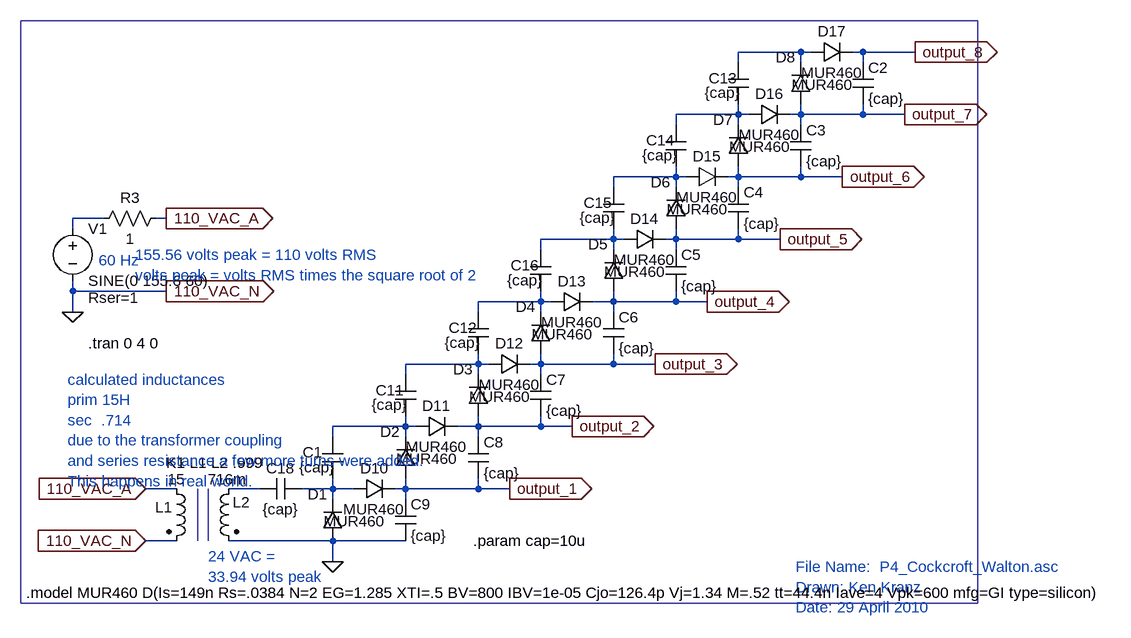
[diagram p0: schematic P4_Cockcroft_Walton.asc]
P4_Cockcroft_Walton.asc, the LTspice schematic file:
Version 4
SHEET 1 2216 1024
WIRE 960 -176 864 -176
WIRE 976 -176 960 -176
WIRE 1056 -176 1040 -176
WIRE 1136 -176 1056 -176
WIRE 864 -160 864 -176
WIRE 960 -160 960 -176
WIRE 1056 -160 1056 -176
WIRE 864 -80 864 -96
WIRE 864 -80 768 -80
WIRE 880 -80 864 -80
WIRE 960 -80 960 -96
WIRE 960 -80 944 -80
WIRE 1056 -80 1056 -96
WIRE 1056 -80 960 -80
WIRE 1120 -80 1056 -80
WIRE 768 -64 768 -80
WIRE 864 -64 864 -80
WIRE 960 -64 960 -80
WIRE 768 16 768 0
WIRE 768 16 672 16
WIRE 784 16 768 16
WIRE 864 16 864 0
WIRE 864 16 848 16
WIRE 960 16 960 0
WIRE 960 16 864 16
WIRE 1024 16 960 16
WIRE 672 32 672 16
WIRE 768 32 768 16
WIRE 864 32 864 16
WIRE -112 80 -160 80
WIRE -16 80 -32 80
WIRE -160 96 -160 80
WIRE 672 112 672 96
WIRE 672 112 560 112
WIRE 688 112 672 112
WIRE 768 112 768 96
WIRE 768 112 752 112
WIRE 864 112 864 96
WIRE 864 112 768 112
WIRE 928 112 864 112
WIRE 560 128 560 112
WIRE 672 128 672 112
WIRE 768 128 768 112
WIRE -160 192 -160 176
WIRE -16 192 -160 192
WIRE 560 208 560 192
WIRE 560 208 464 208
WIRE 576 208 560 208
WIRE 672 208 672 192
WIRE 672 208 640 208
WIRE 768 208 768 192
WIRE 768 208 672 208
WIRE 816 208 768 208
WIRE -160 224 -160 192
WIRE 464 224 464 208
WIRE 560 224 560 208
WIRE 672 224 672 208
WIRE 464 304 464 288
WIRE 464 304 352 304
WIRE 480 304 464 304
WIRE 560 304 560 288
WIRE 560 304 544 304
WIRE 672 304 672 288
WIRE 672 304 560 304
WIRE 736 304 672 304
WIRE 352 320 352 304
WIRE 464 320 464 304
WIRE 560 320 560 304
WIRE 352 400 352 384
WIRE 352 400 240 400
WIRE 368 400 352 400
WIRE 464 400 464 384
WIRE 464 400 432 400
WIRE 560 400 560 384
WIRE 560 400 464 400
WIRE 608 400 560 400
WIRE 240 416 240 400
WIRE 352 416 352 400
WIRE 464 416 464 400
WIRE 0 496 -48 496
WIRE 128 496 80 496
WIRE 240 496 240 480
WIRE 240 496 192 496
WIRE 272 496 240 496
WIRE 352 496 352 480
WIRE 352 496 336 496
WIRE 464 496 464 480
WIRE 464 496 352 496
WIRE 512 496 464 496
WIRE 240 512 240 496
WIRE 352 512 352 496
WIRE 0 576 -48 576
WIRE 240 576 80 576
WIRE 352 576 240 576
WIRE 240 608 240 576
FLAG -48 496 110_VAC_A
IOPIN -48 496 In
FLAG -48 576 110_VAC_N
IOPIN -48 576 In
FLAG -160 224 0
FLAG -16 80 110_VAC_A
IOPIN -16 80 Out
FLAG -16 192 110_VAC_N
IOPIN -16 192 Out
FLAG 240 608 0
FLAG 512 496 output_1
IOPIN 512 496 Out
FLAG 608 400 output_2
IOPIN 608 400 Out
FLAG 736 304 output_3
IOPIN 736 304 Out
FLAG 816 208 output_4
IOPIN 816 208 Out
FLAG 928 112 output_5
IOPIN 928 112 Out
FLAG 1024 16 output_6
IOPIN 1024 16 Out
FLAG 1120 -80 output_7
IOPIN 1120 -80 Out
FLAG 1136 -176 output_8
IOPIN 1136 -176 Out
SYMBOL ind2 -16 480 R0
WINDOW 0 -17 44 Left 0
WINDOW 3 2 1 Left 0
SYMATTR InstName L1
SYMATTR Value 15
SYMATTR Type ind
SYMATTR SpiceLine Rser=1
SYMBOL ind2 96 480 M0
WINDOW 0 -17 37 Left 0
WINDOW 3 -12 1 Left 0
SYMATTR InstName L2
SYMATTR Value 716m
SYMATTR Type ind
SYMATTR SpiceLine Rser=5m
SYMBOL voltage -160 80 R0
WINDOW 123 0 0 Left 0
WINDOW 39 24 122 Left 0
SYMATTR SpiceLine Rser=1
SYMATTR InstName V1
SYMATTR Value SINE(0 155.6 60)
SYMBOL diode 256 576 R180
WINDOW 0 24 72 Left 0
WINDOW 3 -65 30 Left 0
SYMATTR InstName D1
SYMATTR Value MUR460
SYMBOL res -16 64 R90
WINDOW 0 0 56 VBottom 0
WINDOW 3 32 56 VTop 0
SYMATTR InstName R3
SYMATTR Value 1
SYMBOL cap 1040 -160 R0
SYMATTR InstName C2
SYMATTR Value {cap}
SYMBOL cap 944 -64 R0
SYMATTR InstName C3
SYMATTR Value {cap}
SYMBOL cap 848 32 R0
SYMATTR InstName C4
SYMATTR Value {cap}
SYMBOL cap 752 128 R0
SYMATTR InstName C5
SYMATTR Value {cap}
SYMBOL cap 656 224 R0
SYMATTR InstName C6
SYMATTR Value {cap}
SYMBOL cap 544 320 R0
SYMATTR InstName C7
SYMATTR Value {cap}
SYMBOL cap 448 416 R0
SYMATTR InstName C8
SYMATTR Value {cap}
SYMBOL cap 336 512 R0
SYMATTR InstName C9
SYMATTR Value {cap}
SYMBOL cap 224 416 R0
WINDOW 0 -30 24 Left 0
WINDOW 3 -36 47 Left 0
SYMATTR InstName C1
SYMATTR Value {cap}
SYMBOL cap 336 320 R0
WINDOW 0 -30 24 Left 0
WINDOW 3 -36 47 Left 0
SYMATTR InstName C11
SYMATTR Value {cap}
SYMBOL cap 448 224 R0
WINDOW 0 -30 24 Left 0
WINDOW 3 -36 47 Left 0
SYMATTR InstName C12
SYMATTR Value {cap}
SYMBOL cap 192 480 R90
WINDOW 0 0 32 VBottom 0
WINDOW 3 32 32 VTop 0
SYMATTR InstName C18
SYMATTR Value {cap}
SYMBOL cap 848 -160 R0
WINDOW 0 -30 24 Left 0
WINDOW 3 -36 47 Left 0
SYMATTR InstName C13
SYMATTR Value {cap}
SYMBOL cap 752 -64 R0
WINDOW 0 -30 24 Left 0
WINDOW 3 -36 47 Left 0
SYMATTR InstName C14
SYMATTR Value {cap}
SYMBOL cap 656 32 R0
WINDOW 0 -30 24 Left 0
WINDOW 3 -36 47 Left 0
SYMATTR InstName C15
SYMATTR Value {cap}
SYMBOL cap 544 128 R0
WINDOW 0 -30 24 Left 0
WINDOW 3 -36 47 Left 0
SYMATTR InstName C16
SYMATTR Value {cap}
SYMBOL diode 368 480 R180
WINDOW 0 24 72 Left 0
WINDOW 3 -65 30 Left 0
SYMATTR InstName D2
SYMATTR Value MUR460
SYMBOL diode 480 384 R180
WINDOW 0 24 72 Left 0
WINDOW 3 -65 30 Left 0
SYMATTR InstName D3
SYMATTR Value MUR460
SYMBOL diode 576 288 R180
WINDOW 0 24 72 Left 0
WINDOW 3 -65 30 Left 0
SYMATTR InstName D4
SYMATTR Value MUR460
SYMBOL diode 688 192 R180
WINDOW 0 24 72 Left 0
WINDOW 3 -65 30 Left 0
SYMATTR InstName D5
SYMATTR Value MUR460
SYMBOL diode 784 96 R180
WINDOW 0 24 72 Left 0
WINDOW 3 -65 30 Left 0
SYMATTR InstName D6
SYMATTR Value MUR460
SYMBOL diode 880 0 R180
WINDOW 0 24 72 Left 0
WINDOW 3 -65 30 Left 0
SYMATTR InstName D7
SYMATTR Value MUR460
SYMBOL diode 976 -96 R180
WINDOW 0 24 72 Left 0
WINDOW 3 -65 30 Left 0
SYMATTR InstName D8
SYMATTR Value MUR460
SYMBOL diode 272 512 R270
WINDOW 0 32 32 VTop 0
WINDOW 3 0 32 VBottom 0
SYMATTR InstName D10
SYMATTR Value MUR460
SYMBOL diode 368 416 R270
WINDOW 0 32 32 VTop 0
WINDOW 3 0 32 VBottom 0
SYMATTR InstName D11
SYMATTR Value MUR460
SYMBOL diode 480 320 R270
WINDOW 0 32 32 VTop 0
WINDOW 3 0 32 VBottom 0
SYMATTR InstName D12
SYMATTR Value MUR460
SYMBOL diode 576 224 R270
WINDOW 0 32 32 VTop 0
WINDOW 3 0 32 VBottom 0
SYMATTR InstName D13
SYMATTR Value MUR460
SYMBOL diode 688 128 R270
WINDOW 0 32 32 VTop 0
WINDOW 3 0 32 VBottom 0
SYMATTR InstName D14
SYMATTR Value MUR460
SYMBOL diode 784 32 R270
WINDOW 0 32 32 VTop 0
WINDOW 3 0 32 VBottom 0
SYMATTR InstName D15
SYMATTR Value MUR460
SYMBOL diode 880 -64 R270
WINDOW 0 32 32 VTop 0
WINDOW 3 0 32 VBottom 0
SYMATTR InstName D16
SYMATTR Value MUR460
SYMBOL diode 976 -160 R270
WINDOW 0 32 32 VTop 0
WINDOW 3 0 32 VBottom 0
SYMATTR InstName D17
SYMATTR Value MUR460
TEXT -136 272 Left 0 !.tran 0 4 0
TEXT -16 456 Left 0 !K1 L1 L2 .999
TEXT -64 136 Left 0 ;155.56 volts peak = 110 volts RMS\nvolts peak = volts RMS times the square root of 2
TEXT -120 144 Left 0 ;60 Hz
TEXT -168 328 Left 0 ;calculated inductances\nprim 15H \nsec  .714\ndue to the transformer coupling\nand series resistance a few more turns were added.\nThis happens in real world.
TEXT 48 600 Left 0 ;24 VAC = \n33.94 volts peak
TEXT 952 616 Left 0 ;File Name:  P4_Cockcroft_Walton.asc \nDrawn: Ken Kranz\nDate: 29 April 2010
TEXT 456 576 Left 0 !.param cap=10u
TEXT -232 656 Left 0 !.model MUR460 D(Is=149n Rs=.0384 N=2 EG=1.285 XTI=.5 BV=800 IBV=1e-05 Cjo=126.4p Vj=1.34 M=.52 tt=44.4n Iave=4 Vpk=600 mfg=GI type=silicon)
LINE Normal 32 576 32 496
LINE Normal 48 576 48 496
RECTANGLE Normal 1232 -224 -240 672

The netlist it stands for:
* P4_Cockcroft_Walton.asc
L1 110_VAC_A 0 15 Rser=1
L2 N009 0 716m Rser=5m
V1 N004 0 SINE(0 155.6 60) Rser=1
D1 0 N010 MUR460
R3 110_VAC_A N004 1
C2 output_8 output_7 {cap}
C3 output_7 output_6 {cap}
C4 output_6 output_5 {cap}
C5 output_5 output_4 {cap}
C6 output_4 output_3 {cap}
C7 output_3 output_2 {cap}
C8 output_2 output_1 {cap}
C9 output_1 0 {cap}
C1 N008 N010 {cap}
C11 N007 N008 {cap}
C12 N006 N007 {cap}
C18 N010 N009 {cap}
C13 N001 N002 {cap}
C14 N002 N003 {cap}
C15 N003 N005 {cap}
C16 N005 N006 {cap}
D2 output_1 N008 MUR460
D3 output_2 N007 MUR460
D4 output_3 N006 MUR460
D5 output_4 N005 MUR460
D6 output_5 N003 MUR460
D7 output_6 N002 MUR460
D8 output_7 N001 MUR460
D10 N010 output_1 MUR460
D11 N008 output_2 MUR460
D12 N007 output_3 MUR460
D13 N006 output_4 MUR460
D14 N005 output_5 MUR460
D15 N003 output_6 MUR460
D16 N002 output_7 MUR460
D17 N001 output_8 MUR460
.model D D
.lib standard.dio
.tran 0 4 0
K1 L1 L2 .999
* 155.56 volts peak = 110 volts RMS
* volts peak = volts RMS times the square root of 2
* 60 Hz
* calculated inductances
* prim 15H
* sec  .714
* due to the transformer coupling
* and series resistance a few more turns were added.
* This happens in real world.
* 24 VAC =
* 33.94 volts peak
* File Name:  P4_Cockcroft_Walton.asc
* Drawn: Ken Kranz
* Date: 29 April 2010
.param cap=10u
.model MUR460 D(Is=149n Rs=.0384 N=2 EG=1.285 XTI=.5 BV=800 IBV=1e-05 Cjo=126.4p Vj=1.34 M=.52 tt=44.4n Iave=4 Vpk=600 mfg=GI type=silicon)
.backanno
.end